# Altium schematic sheet Sheet3.SchDoc
size A3; SheetNumber: 1; SheetTotal: 2
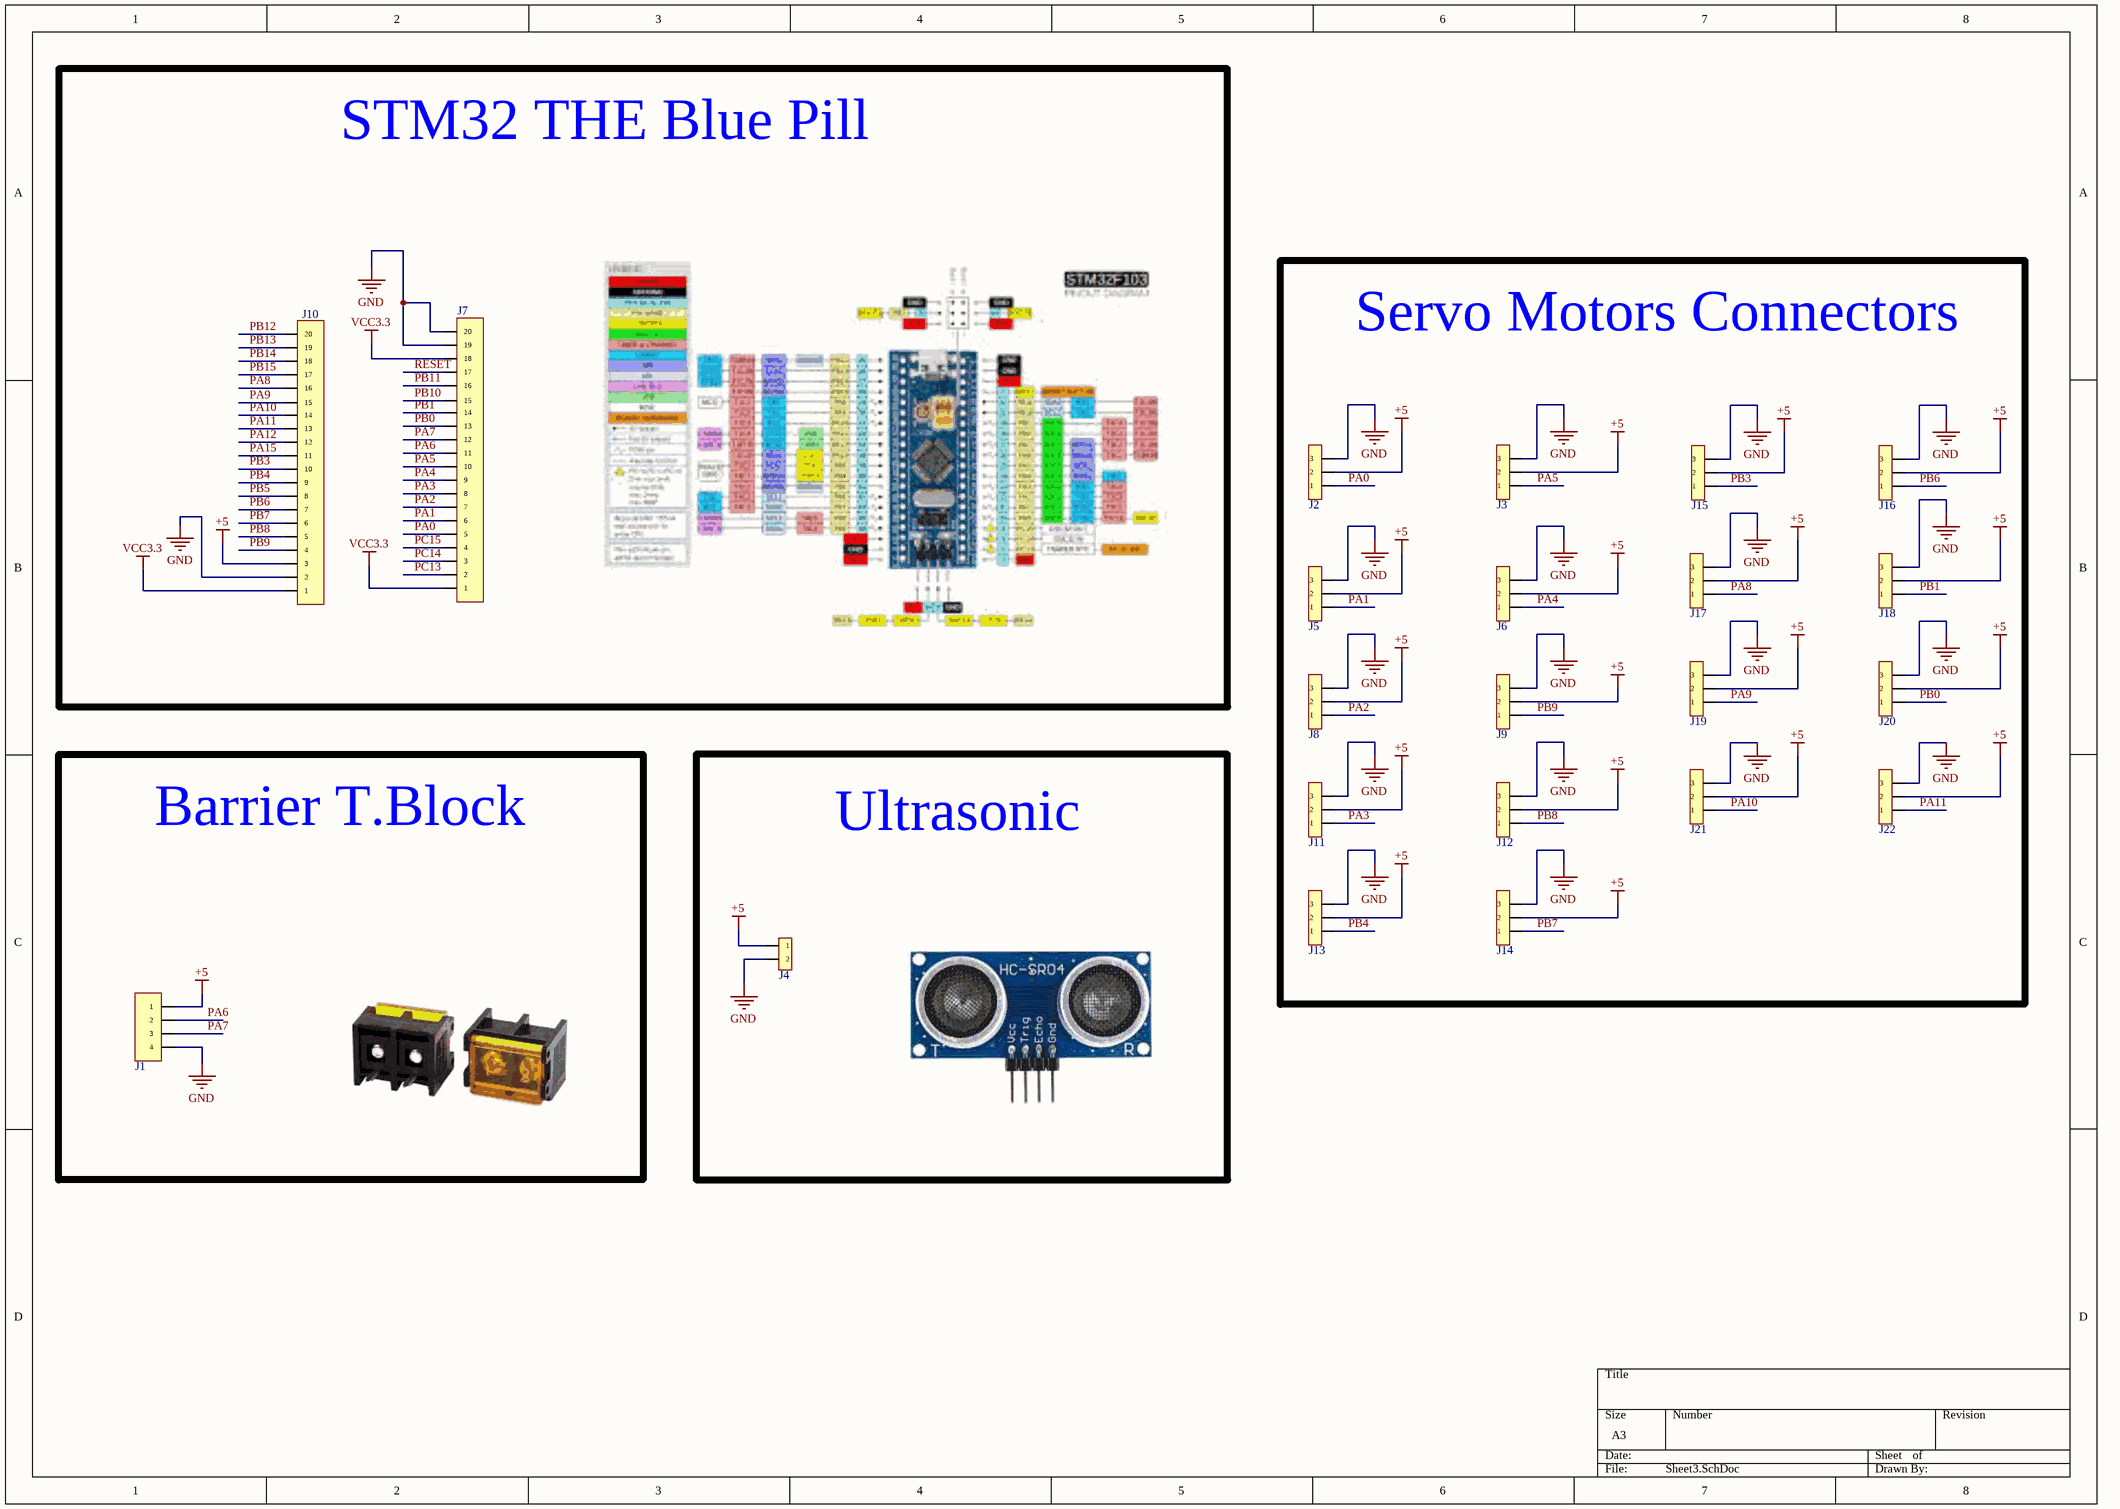
[diagram p0: Sheet3.SchDoc]

## Parts
J1  Pin headers 4P  [connector (4 pin)]  (value not drawn)
J2  Pin headers 3P  [connector (3 pin)]  (value not drawn)
J3  Pin headers 3P  [connector (3 pin)]  (value not drawn)
J4  con 2P  [con 2P]  (value not drawn)
J5  Pin headers 3P  [connector (3 pin)]  (value not drawn)
J6  Pin headers 3P  [connector (3 pin)]  (value not drawn)
J7  Pin headers 20P  [connector (20pin) - duplicate]  (value not drawn)
J8  Pin headers 3P  [connector (3 pin)]  (value not drawn)
J9  Pin headers 3P  [connector (3 pin)]  (value not drawn)
J10  Pin headers 20P  [connector (20pin) - duplicate]  (value not drawn)
J11  Pin headers 3P  [connector (3 pin)]  (value not drawn)
J12  Pin headers 3P  [connector (3 pin)]  (value not drawn)
J13  Pin headers 3P  [connector (3 pin)]  (value not drawn)
J14  Pin headers 3P  [connector (3 pin)]  (value not drawn)
J15  Pin headers 3P  [connector (3 pin)]  (value not drawn)
J16  Pin headers 3P  [connector (3 pin)]  (value not drawn)
J17  Pin headers 3P  [connector (3 pin)]  (value not drawn)
J18  Pin headers 3P  [connector (3 pin)]  (value not drawn)
J19  Pin headers 3P  [connector (3 pin)]  (value not drawn)
J20  Pin headers 3P  [connector (3 pin)]  (value not drawn)
J21  Pin headers 3P  [connector (3 pin)]  (value not drawn)
J22  Pin headers 3P  [connector (3 pin)]  (value not drawn)

## Blocks framed on the sheet
STM32 THE Blue Pill: J7 J10
Servo Motors Connectors: J2 J3 J5 J6 J8 J9 J11-J22
Barrier T.Block: J1
Ultrasonic: J4

## Nets
+5: J1.1 J2.10(2) J3.10(2) J4.9(1) J5.10(2) J6.10(2) J8.10(2) J9.10(2) J10.3 J11.10(2) J12.10(2) J13.10(2) J14.10(2) J15.10(2) J16.10(2) J17.10(2) J18.10(2) J19.10(2) J20.10(2) J21.10(2) J22.10(2)
GND: J1.4 J2.3 J3.3 J4.10(2) J5.3 J6.3 J7.19 J7.20 J8.3 J9.3 J10.2 J11.3 J12.3 J13.3 J14.3 J15.3 J16.3 J17.3 J18.3 J19.3 J20.3 J21.3 J22.3
VCC3.3: J7.1 J7.18 J10.1
PA0: J2.9(1) J7.5
PA1: J5.9(1) J7.6
PA2: J7.7 J8.9(1)
PA3: J7.8 J11.9(1)
PA4: J6.9(1) J7.9
PA5: J3.9(1) J7.10
PA6: J1.2 J7.11
PA7: J1.3 J7.12
PA8: J10.16 J17.9(1)
PA9: J10.15 J19.9(1)
PA10: J10.14 J21.9(1)
PA11: J10.13 J22.9(1)
PA12: J10.12
PA15: J10.11
PB0: J7.13 J20.9(1)
PB1: J7.14 J18.9(1)
PB3: J10.10 J15.9(1)
PB4: J10.9 J13.9(1)
PB5: J10.8
PB6: J10.7 J16.9(1)
PB7: J10.6 J14.9(1)
PB8: J10.5 J12.9(1)
PB9: J9.9(1) J10.4
PB10: J7.15
PB11: J7.16
PB12: J10.20
PB13: J10.19
PB14: J10.18
PB15: J10.17
PC13: J7.2
PC14: J7.3
PC15: J7.4
RESET: J7.17

## Library data of the parts
J1 = Pin headers 4P: 4P 2.54mm Plugin 1x4P Plugin,P=2.54mm Pin Headers ROHS; Manufacturer: ZHOURI; Manufacturer part Number: 2.54-1*4; Supplier: LCSC; Supplier part Number: C5116483
J2 J3 J5 J6 J8 J9 J11-J22 = Pin headers 3P: 3A Straight Square Pins 3P -40℃~+105℃ 2.54mm Plugin Black 1x3P Plugin,P=2.54mm Pin Headers ROHS; Manufacturer: BOOMELE(Boom Precision Elec); Manufacturer part Number: 2.54-1*3P; Supplier: LCSC; Supplier part Number: C49257
J7 J10 = Pin headers 20P: 3A Direct Insert Policy 20P -40℃~+105℃ 2.54mm Single Row Black Brass 1x20P Plugin,P=2.54mm Pin Headers ROHS; Manufacturer: BOOMELE(Boom Precision Elec); Manufacturer part Number: 2.54-1*20P; Supplier: LCSC; Supplier part Number: C50981